# Altium schematic sheet SENSORS.SchDoc
size A4; SheetNumber: 6; SheetTotal: 7
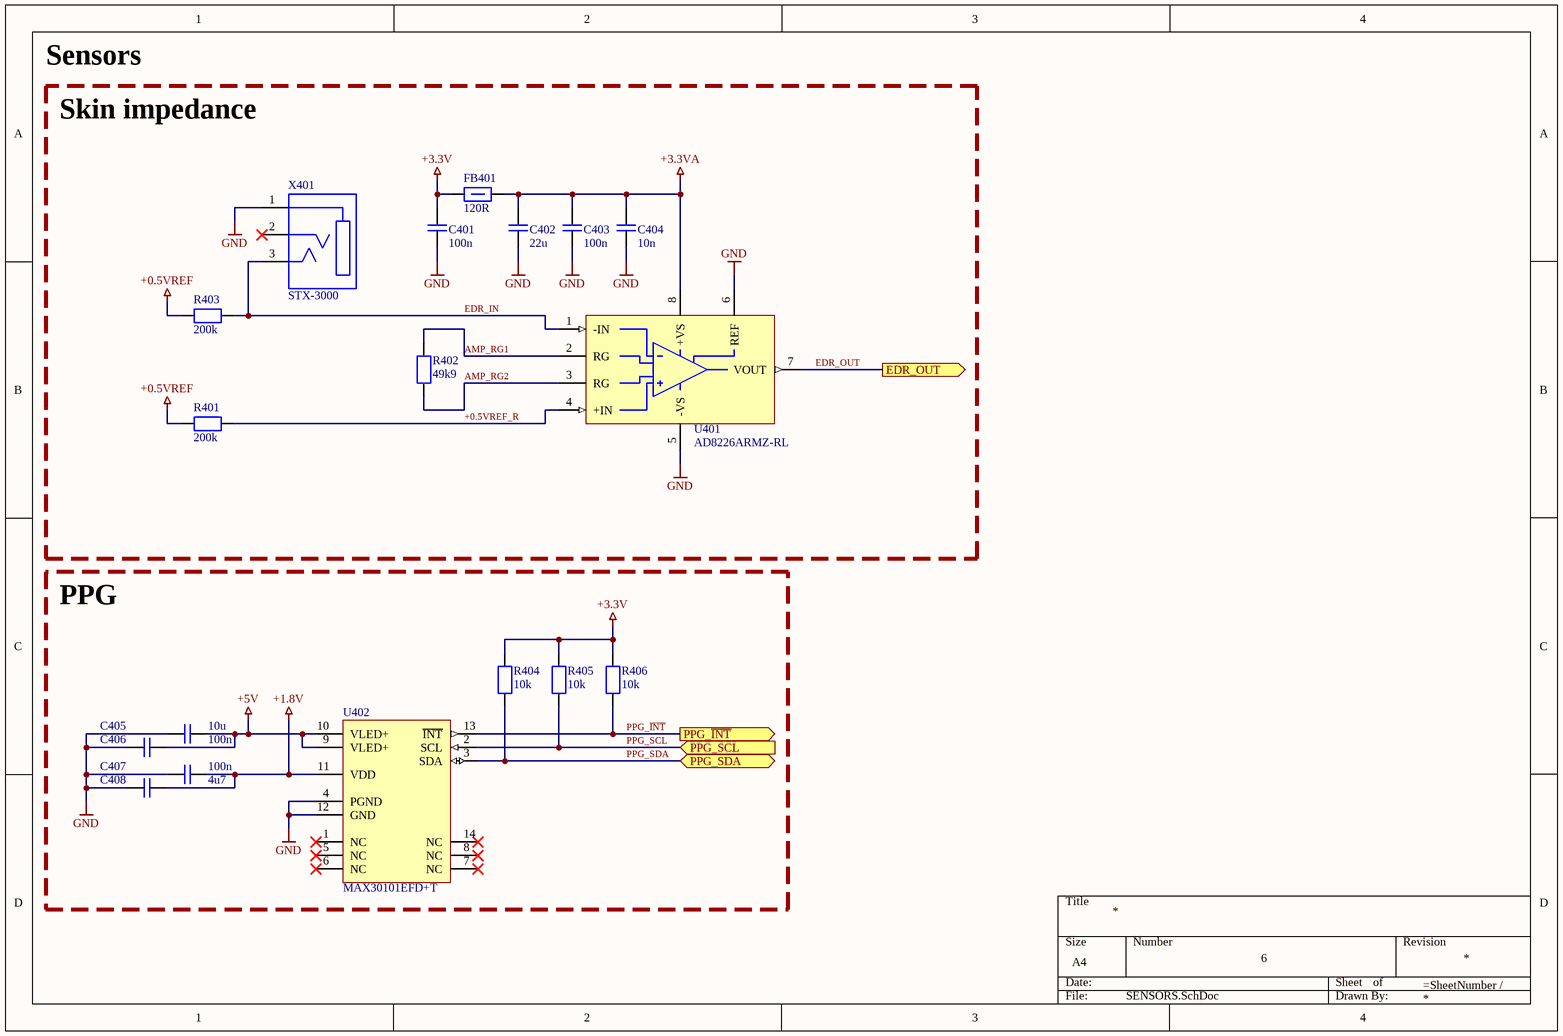
[diagram p0: SENSORS.SchDoc]

## Parts
C401  100n  [CAPC0603]
C402  22u  [CAPC0603]
C403  100n  [CAPC0603]
C404  10n  [CAPC0603]
C405  10u  [CAPC0603]
C406  100n  [CAPC0603]
C407  100n  [CAPC0603]
C408  4u7  [CAPC0603]
FB401  120R  [FBC0603]
R401  200k  [RESC0603]
R402  49k9  [RESC0603]
R403  200k  [RESC0805]
R404  10k  [RESC0603]
R405  10k  [RESC0603]
R406  10k  [RESC0603]
U401  AD8226ARMZ-RL  [SOP65P530X110-8]
U402  MAX30101EFD+T  [QFN80P330X560X155-14]
X401  STX-3000  [AUDIO STX-3000]

## Blocks framed on the sheet
PPG: C405-C408 R404-R406 U402

## Ports
EDR_OUT (out, see WIRELESS[1B]), PPG_SCL (in, see WIRELESS[1B]), PPG_SDA (bidir, see WIRELESS[1B]), PPG_~{INT} (out, see WIRELESS[1B])

## Nets
+0.5VREF: R401.2 R403.1
+1.8V: C407.2 C408.2 U402.11(VDD)
+3.3V: C401.2 FB401.1 R404.2 R405.2 R406.2
+3.3VA: C402.2 C403.2 C404.2 FB401.2 U401.8(+VS)
+5V: C405.2 C406.2 U402.9(VLED+) U402.10(VLED+)
GND: C401.1 C402.1 C403.1 C404.1 C405.1 C406.1 C407.1 C408.1 U401.5(-VS) U401.6(REF) U402.4(PGND) U402.12(GND) X401.1
+0.5VREF_R: R401.1 U401.4(+IN)
AMP_RG1: R402.2 U401.2(RG)
AMP_RG2: R402.1 U401.3(RG)
EDR_IN: R403.2 U401.1(-IN) X401.3
EDR_OUT: U401.7(VOUT) ; port EDR_OUT
PPG_~{INT}: R406.1 U402.13(~{INT}) ; port PPG_~{INT}
PPG_SCL: R405.1 U402.2(SCL) ; port PPG_SCL
PPG_SDA: R404.1 U402.3(SDA) ; port PPG_SDA

Not connected (* = marked no-connect by the designer): U402 1(NC)* 5(NC)* 6(NC)* 7(NC)* 8(NC)* 14(NC)*; X401 2*

## Notes on the sheet
- Sensors
- Skin impedance

## Library data of the parts
C401 C403 C406 C407 = CAPC0603-100n-10: Ceramic capacitor, 100nF,  50V, X7R; MFR: KEMET; MFRN: C0603C104K5RACAUTO; SPN: 80-C0603C104K5RAUTO; Checked: Yes; Footprint: 0603; Supplier: Mouser; Link: https://hr.mouser.com/ProductDetail/KEMET/C0603C104K5RACAUTO?qs=8xX%252BF9%252BWV6EZsgKw9G0PqQ%3D%3D
C402 = CAPC0603-22u-20: Ceramic capacitor, 22uF,  10V, X5R; MFR: Samsung Electro-Mechanics; MFRN: CL10A226MP8NUNE; SPN: 187-CL10A226MP8NUNE; Checked: Yes; Footprint: 0603; Supplier: Mouser; Link: https://hr.mouser.com/ProductDetail/Samsung-Electro-Mechanics/CL10A226MP8NUNE?qs=gRKWieUq2Hb5O0PTfRKzDQ%3D%3D
C404 = CAPC0603-10n-20: Ceramic capacitor, 10nF,  50V, X7R; MFR: KEMET; MFRN: C0603C103K5RAC7081; SPN: 80-C0603C103K5R7081; Checked: Yes; Footprint: 0603; Supplier: Mouser; Link: https://hr.mouser.com/ProductDetail/KEMET/C0603C103K5RAC7081?qs=sSYV1F9c5cFnAwHdDYKUcw%3D%3D
C405 = CAPC0603-10u-20: Ceramic capacitor, 10uF,  25V, X5R; MFR: TAIYO YUDEN; MFRN: TMK107BBJ106MA-T; SPN: 963-TMK107BBJ106MA-T; Checked: Yes; Footprint: 0603; Supplier: Mouser; Link: https://hr.mouser.com/ProductDetail/TAIYO-YUDEN/TMK107BBJ106MA-T?qs=lkMpTOwszhf2a50BCYsq8A%3D%3D
C408 = CAPC0603-4u7-10: Ceramic capacitor, 4.7uF, 25V, X5R; MFR: TDK; MFRN: C1608X5R1E475K080AC; SPN: 810-C1608X5R1E475K; Checked: Yes; Footprint: 0603; Supplier: Mouser; Link: https://hr.mouser.com/ProductDetail/TDK/C1608X5R1E475K080AC?qs=dfay7wIA1uHUGZGvnFtOyQ%3D%3D
FB401 = FB0603-120R: Ferrite bead, 120R@100MHz; MFR: TDK Corporation; MFRN: MMZ1608D121CTDH5; SPN: 445-MMZ1608D121CTDH5TR-ND; Checked: Yes; Footprint: 0603; Supplier: Mouser; Link: https://hr.mouser.com/ProductDetail/TDK/MMZ1608D121CTDH5?qs=w5GL7EWTenmYwq5el8mPmQ%3D%3D
R401 = RES0603-200k-1: Thick film resistor, 200kOhms, 100mW; MFR: YAGEO; MFRN: RC0603FR-07200KL; SPN: 603-RC0603FR-07200KL; Checked: Yes; Footprint: 0603; Supplier: Mouser; Link: https://hr.mouser.com/ProductDetail/YAGEO/RC0603FR-07200KL?qs=sGAEpiMZZMtlubZbdhIBIPpBVm91En7n1EStA3IWCIA%3D
R402 = RES0603-49k9-1: Thick film resistor, 49.9kOhms, 100mW; MFR: YAGEO; MFRN: RC0603FR-0749K9L; SPN: 603-RC0603FR-0749K9L; Checked: Yes; Footprint: 0603; Supplier: Mouser; Link: https://hr.mouser.com/ProductDetail/YAGEO/RC0603FR-0749K9L?qs=sGAEpiMZZMtlubZbdhIBIItYu4jZFrq85kB0%2FAGdri8%3D
R403 = RES0805-200k-1: Thick film resistor, 200k, 125mW; MFR: YAGEO; MFRN: RC0805FR-07200KL; SPN: 603-RC0805FR-07200KL; Checked: No; Footprint: 0805; Supplier: Mouser; Link: https://hr.mouser.com/ProductDetail/YAGEO/RC0805FR-07200KL?qs=sGAEpiMZZMtlubZbdhIBIBEZimkhVqQ42qt0Z2hzgyc%3D
R404-R406 = RES0603-10k-1: Thick film resistor, 10kOhm, 100mW; MFR: YAGEO; MFRN: RC0603FR-1010KL; SPN: 603-RC0603FR-1010KL; Checked: Yes; Footprint: 0603; Supplier: Mouser; Link: https://hr.mouser.com/ProductDetail/YAGEO/RC0603FR-1010KL?qs=sGAEpiMZZMtlubZbdhIBIHvQf5egq9lvqRHakiGwa0o%3D
U401 = AD8226ARMZ-RL: Instrumentation Amplifier, 1 CH; MFR: Analog Devices; SPN: 584-AD8226ARMZ-R; Checked: No; Footprint: MSOP-8; Supplier: Mouser; MFRN: AD8226ARMZ-RL; Link: https://hr.mouser.com/ProductDetail/Analog-Devices/AD8226ARMZ-RL?qs=sGAEpiMZZMtuedWc5vOqGOg2P2zBW3ua3%252BX8tTUXoKc%3D
U402 = BIO IC MAX30101EFD+T: Pulse Oximeter and Heart-Rate Sensor for Wearable Health; MFR: Analog Devices Inc./Maxim Integrated; SPN: 700-MAX30101EFD+T; Checked: No; Footprint: ?; Supplier: Mouser; MFRN: MAX30101EFD+T; Link: https://hr.mouser.com/ProductDetail/Analog-Devices-Maxim-Integrated/MAX30101EFD%2bT?qs=sITqEBh490kEm6CNcTH1tQ%3D%3D
X401 = AUDIO STX-3000: 3.5mm Audio connector, 3POS; MFR: Kycon; SPN: 806-STX-3000; Checked: No; Supplier: Mouser; MFRN: STX-3000; Link: https://hr.mouser.com/ProductDetail/Kycon/STX-3000?qs=sGAEpiMZZMv0W4pxf2HiV8G8PVhdMuD0EShHAQC6epY%3D